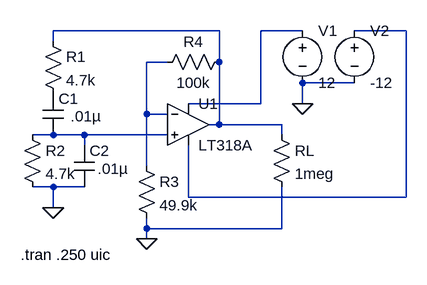
[diagram p0: schematic wien-osc.asc]
wien-osc.asc, the LTspice schematic file:
Version 4
SHEET 1 880 680
WIRE 432 0 176 0
WIRE 560 0 496 0
WIRE 720 0 640 0
WIRE 176 16 176 0
WIRE 352 48 320 48
WIRE 432 48 432 0
WIRE 640 80 560 80
WIRE 496 112 496 0
WIRE 496 112 384 112
WIRE 560 112 560 80
WIRE 320 128 320 48
WIRE 352 128 320 128
WIRE 432 144 432 48
WIRE 432 144 416 144
WIRE 528 144 432 144
WIRE 176 160 144 160
WIRE 224 160 176 160
WIRE 352 160 224 160
WIRE 528 160 528 144
WIRE 224 176 224 160
WIRE 320 208 320 128
WIRE 176 240 144 240
WIRE 224 240 176 240
WIRE 384 256 384 176
WIRE 720 256 720 0
WIRE 720 256 384 256
WIRE 176 272 176 240
WIRE 320 304 320 288
WIRE 528 304 528 240
WIRE 528 304 320 304
WIRE 320 320 320 304
FLAG 176 272 0
FLAG 320 320 0
FLAG 560 112 0
SYMBOL res 128 144 R0
SYMATTR InstName R2
SYMATTR Value 4.7k
SYMBOL res 160 0 R0
SYMATTR InstName R1
SYMATTR Value 4.7k
SYMBOL cap 160 96 R0
WINDOW 3 43 35 Left 2
SYMATTR InstName C1
SYMATTR Value .01µ
SYMBOL cap 208 176 R0
WINDOW 3 36 36 Left 2
SYMATTR InstName C2
SYMATTR Value .01µ
SYMBOL res 512 144 R0
SYMATTR InstName RL
SYMATTR Value 1meg
SYMBOL res 304 192 R0
SYMATTR InstName R3
SYMATTR Value 49.9k
SYMBOL res 448 32 R90
WINDOW 0 0 56 VBottom 2
WINDOW 3 32 56 VTop 2
SYMATTR InstName R4
SYMATTR Value 100k
SYMBOL voltage 560 -16 R0
WINDOW 123 0 0 Left 2
WINDOW 39 0 0 Left 2
SYMATTR InstName V1
SYMATTR Value 12
SYMBOL voltage 640 -16 R0
WINDOW 123 0 0 Left 2
WINDOW 39 0 0 Left 2
SYMATTR InstName V2
SYMATTR Value -12
SYMBOL Opamps\\LT318A 384 144 R0
SYMATTR InstName U1
TEXT 126 344 Left 2 !.tran .250 uic

The netlist it stands for:
* wien-osc.asc
R2 N005 0 4.7k
R1 N001 P001 4.7k
C1 P001 N005 .01µ
C2 N005 0 .01µ
RL N001 0 1meg
R3 N004 0 49.9k
R4 N001 N004 100k
V1 N002 0 12
V2 N003 0 -12
* U1: LT318A (symbol Opamps\LT318A not available, pins judged from their places): In+=N005 In-=N004 V+=N002 V-=N003 OUT=N001
.tran .250 uic
.backanno
.end